# EAGLE design PCB-TLY-BRD-U (EAGLE 6.4)
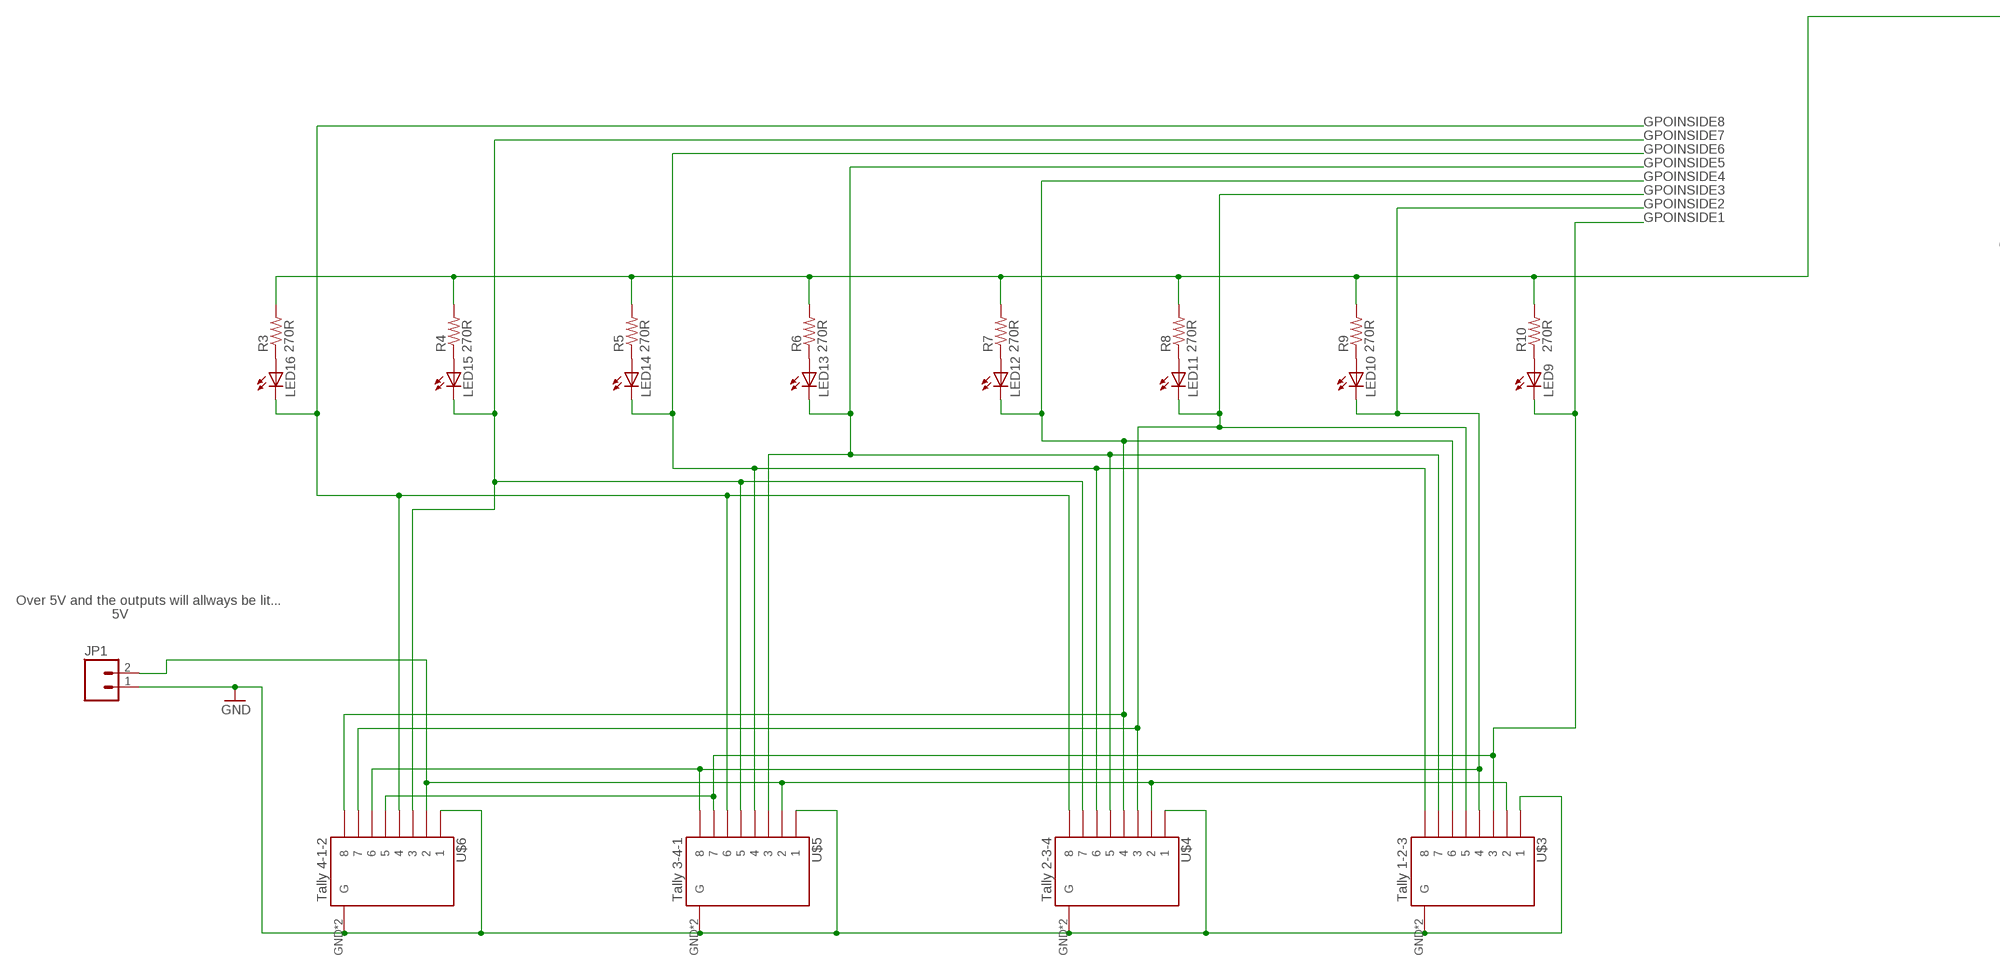
[diagram p0: schematic, sheet 1, part 1 of 2]
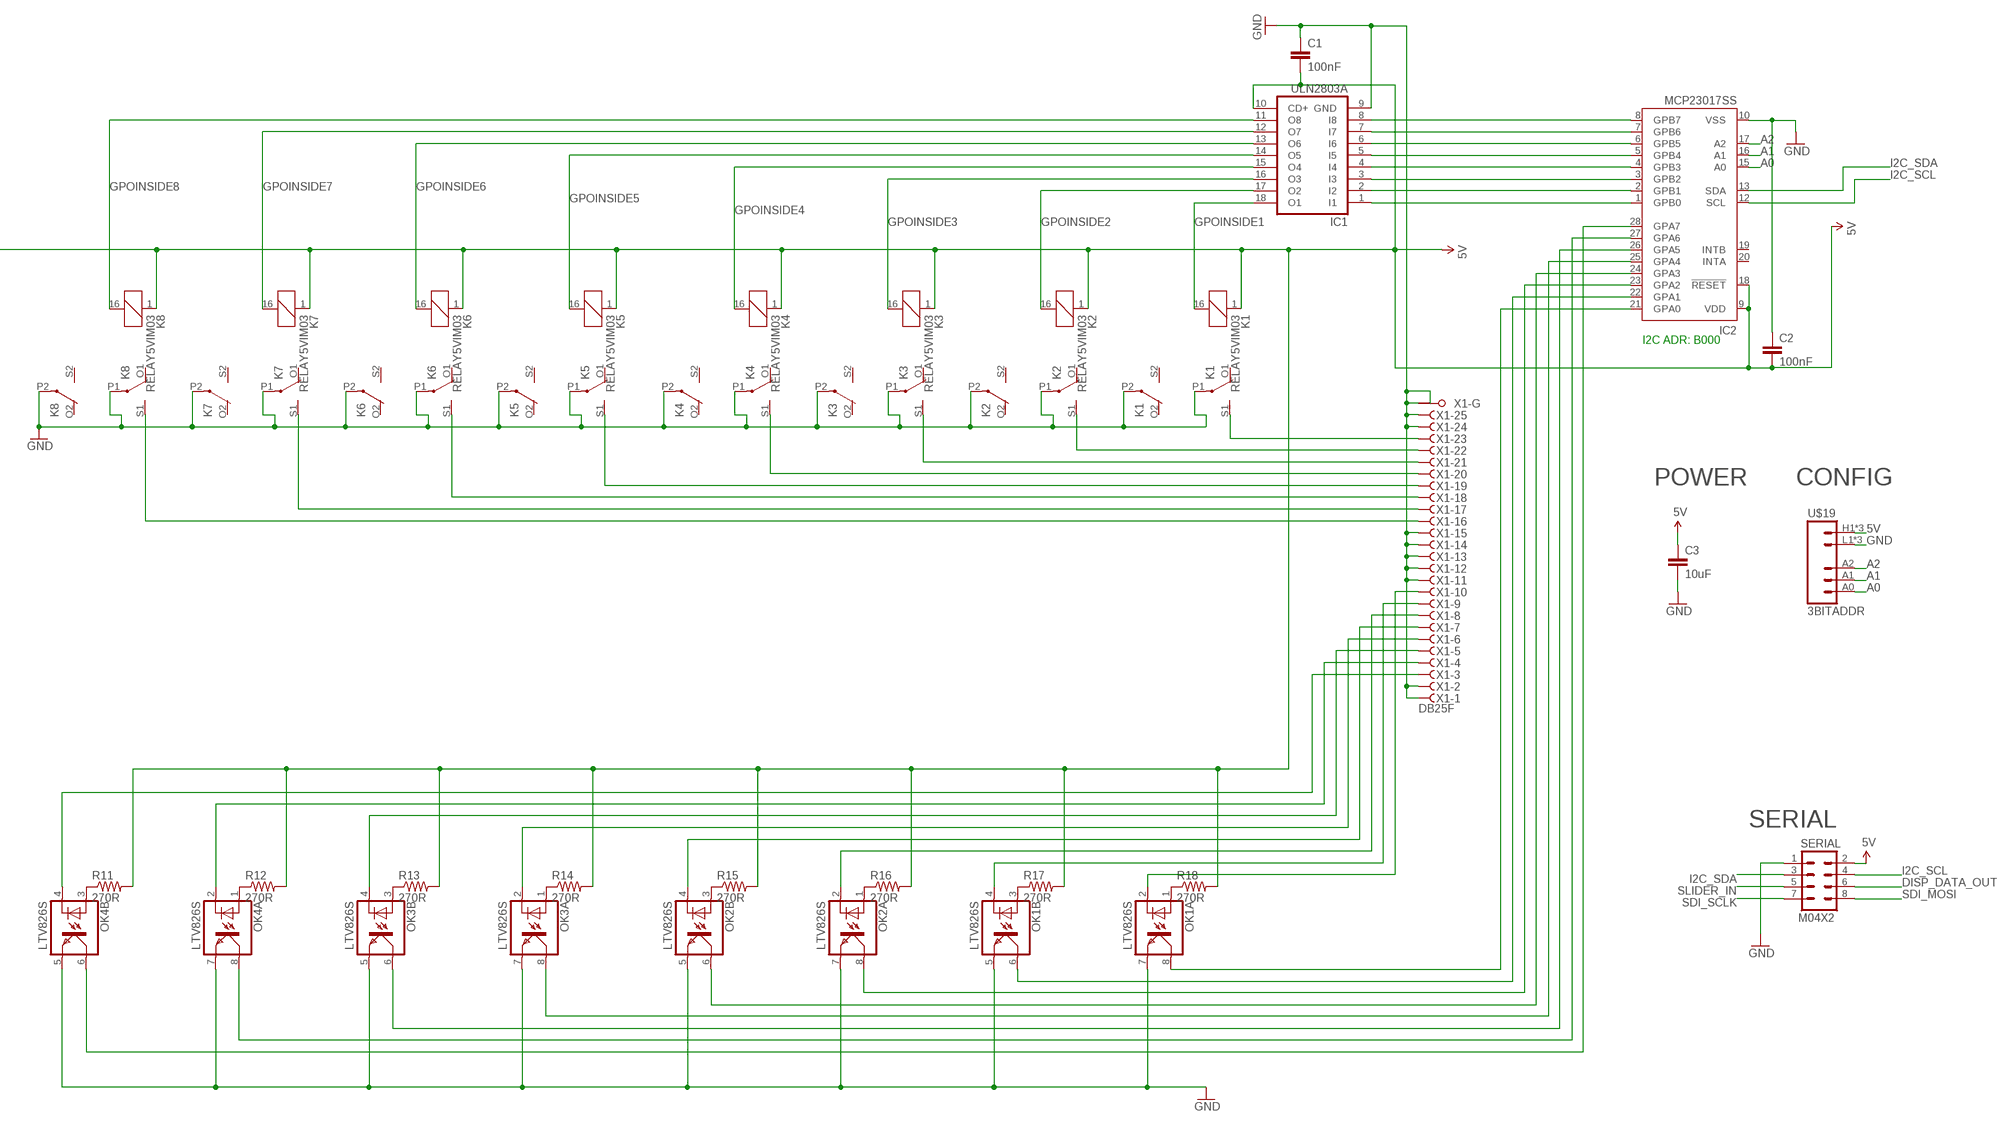
[diagram p1: schematic, sheet 1, part 2 of 2]

## Parts
C1  100nF  CAP0805  [0805]
C2  100nF  CAP0603-CAP  [0603-CAP]
C3  10uF  CAP0805  [0805]
IC1  ULN2803A  ULN2803ASO18W  [SO18W]
IC2  MCP23017SS  [SSOP28]
JP1  M02PTH4  [1X02_XTRA_BIG]
K1  RELAY5VIM03  [DS2Y]
K2  RELAY5VIM03  [DS2Y]
K3  RELAY5VIM03  [DS2Y]
K4  RELAY5VIM03  [DS2Y]
K5  RELAY5VIM03  [DS2Y]
K6  RELAY5VIM03  [DS2Y]
K7  RELAY5VIM03  [DS2Y]
K8  RELAY5VIM03  [DS2Y]
LED9  LED3MM  [LED3MM]
LED10  LED3MM  [LED3MM]
LED11  LED3MM  [LED3MM]
LED12  LED3MM  [LED3MM]
LED13  LED3MM  [LED3MM]
LED14  LED3MM  [LED3MM]
LED15  LED3MM  [LED3MM]
LED16  LED3MM  [LED3MM]
OK1  LTV826S  [DIL8-SMD]
OK2  LTV826S  [DIL8-SMD]
OK3  LTV826S  [DIL8-SMD]
OK4  LTV826S  [DIL8-SMD]
R3  270R  RESISTOR0603-RES  [0603-RES]
R4  270R  RESISTOR0603-RES  [0603-RES]
R5  270R  RESISTOR0603-RES  [0603-RES]
R6  270R  RESISTOR0603-RES  [0603-RES]
R7  270R  RESISTOR0603-RES  [0603-RES]
R8  270R  RESISTOR0603-RES  [0603-RES]
R9  270R  RESISTOR0603-RES  [0603-RES]
R10  270R  RESISTOR0603-RES  [0603-RES]
R11  270R  RESISTOR0603-RES  [0603-RES]
R12  270R  RESISTOR0603-RES  [0603-RES]
R13  270R  RESISTOR0603-RES  [0603-RES]
R14  270R  RESISTOR0603-RES  [0603-RES]
R15  270R  RESISTOR0603-RES  [0603-RES]
R16  270R  RESISTOR0603-RES  [0603-RES]
R17  270R  RESISTOR0603-RES  [0603-RES]
R18  270R  RESISTOR0603-RES  [0603-RES]
SERIAL  M04X2  [2X4]
U$3  Tally 1-2-3  RJ45-8_GND  [RJ45-8_GND]
U$4  Tally 2-3-4  RJ45-8_GND  [RJ45-8_GND]
U$5  Tally 3-4-1  RJ45-8_GND  [RJ45-8_GND]
U$6  Tally 4-1-2  RJ45-8_GND  [RJ45-8_GND]
U$19  3BITADDR  [3BITADDR]
X1  DB25F  F25HPS  [F25HP]

## Nets
5V [Power]: C1.2 C2.2 C3.1 IC1.10(CD+) IC2.9(VDD) IC2.18(!RESET) K1.1 K2.1 K3.1 K4.1 K5.1 K6.1 K7.1 K8.1 R3.2 R4.2 R5.2 R6.2 R7.2 R8.2 R9.2 R10.2 R11.2 R12.2 R13.2 R14.2 R15.2 R16.2 R17.2 R18.2 SERIAL.2 U$19.H1(VCC) U$19.H2(VCC) U$19.H3(VCC)
A0: IC2.15(A0) U$19.A0
A1: IC2.16(A1) U$19.A1
A2: IC2.17(A2) U$19.A2
DISP_DATA_OUT: SERIAL.6
GND [Power]: C1.1 C2.1 C3.2 IC1.9(GND) IC2.10(VSS) JP1.1 K1.P1(2:P) K1.P2(3:P) K2.P1(2:P) K2.P2(3:P) K3.P1(2:P) K3.P2(3:P) K4.P1(2:P) K4.P2(3:P) K5.P1(2:P) K5.P2(3:P) K6.P1(2:P) K6.P2(3:P) K7.P1(2:P) K7.P2(3:P) K8.P1(2:P) K8.P2(3:P) OK1.5(B:EMIT) OK1.7(A:EMIT) OK2.5(B:EMIT) OK2.7(A:EMIT) OK3.5(B:EMIT) OK3.7(A:EMIT) OK4.5(B:EMIT) OK4.7(A:EMIT) SERIAL.1 U$3.1 U$3.GND1(G) U$3.GND(G) U$4.1 U$4.GND1(G) U$4.GND(G) U$5.1 U$5.GND1(G) U$5.GND(G) U$6.1 U$6.GND1(G) U$6.GND(G) U$19.L1(GND) U$19.L2(GND) U$19.L3(GND) X1.1(-1:F) X1.2(-2:F) X1.11(-11:F) X1.12(-12:F) X1.13(-13:F) X1.14(-14:F) X1.15(-15:F) X1.24(-24:F) X1.25(-25:F) X1.G1(-G:G1) X1.G2(-G:G2)
GPOINSIDE1: IC1.18(O1) K1.16 LED9.K(C) U$3.3 U$5.7 U$6.5
GPOINSIDE2: IC1.17(O2) K2.16 LED10.K(C) U$3.4 U$5.8 U$6.6
GPOINSIDE3: IC1.16(O3) K3.16 LED11.K(C) U$3.5 U$4.3 U$6.7
GPOINSIDE4: IC1.15(O4) K4.16 LED12.K(C) U$3.6 U$4.4 U$6.8
GPOINSIDE5: IC1.14(O5) K5.16 LED13.K(C) U$3.7 U$4.5 U$5.3
GPOINSIDE6: IC1.13(O6) K6.16 LED14.K(C) U$3.8 U$4.6 U$5.4
GPOINSIDE7: IC1.12(O7) K7.16 LED15.K(C) U$4.7 U$5.5 U$6.3
GPOINSIDE8: IC1.11(O8) K8.16 LED16.K(C) U$4.8 U$5.6 U$6.4
I2C_SCL: IC2.12(SCL) SERIAL.4
I2C_SDA: IC2.13(SDA) SERIAL.3
N$1 [RELAY LINES]: K1.S1(2:S) X1.23(-23:F)
N$2: LED16.A R3.1
N$3: LED15.A R4.1
N$4: LED14.A R5.1
N$5: IC1.1(I1) IC2.1(GPB0)
N$6 [RELAY LINES]: K2.S1(2:S) X1.22(-22:F)
N$7: LED13.A R6.1
N$8: LED12.A R7.1
N$9: LED11.A R8.1
N$10 [RELAY LINES]: K3.S1(2:S) X1.21(-21:F)
N$11: LED10.A R9.1
N$12: LED9.A R10.1
N$13: OK4.3(B:A) R11.1
N$14 [RELAY LINES]: K4.S1(2:S) X1.20(-20:F)
N$15: OK4.1(A:A) R12.1
N$16: OK3.3(B:A) R13.1
N$17: OK3.1(A:A) R14.1
N$18 [RELAY LINES]: K5.S1(2:S) X1.19(-19:F)
N$19: OK2.3(B:A) R15.1
N$20: OK2.1(A:A) R16.1
N$21: OK1.3(B:A) R17.1
N$22 [RELAY LINES]: K6.S1(2:S) X1.18(-18:F)
N$23: OK1.1(A:A) R18.1
N$26 [RELAY LINES]: K7.S1(2:S) X1.17(-17:F)
N$30 [RELAY LINES]: K8.S1(2:S) X1.16(-16:F)
N$34: IC1.2(I2) IC2.2(GPB1)
N$35: IC1.3(I3) IC2.3(GPB2)
N$36: IC1.4(I4) IC2.4(GPB3)
N$37: IC1.5(I5) IC2.5(GPB4)
N$38: IC1.6(I6) IC2.6(GPB5)
N$39: IC1.7(I7) IC2.7(GPB6)
N$40: IC1.8(I8) IC2.8(GPB7)
N$49 [INput lines]: OK1.2(A:C) X1.10(-10:F)
N$51: IC2.21(GPA0) OK1.8(A:COL)
N$55 [INput lines]: OK3.2(A:C) X1.6(-6:F)
N$60 [INput lines]: OK1.4(B:C) X1.9(-9:F)
N$61 [INput lines]: OK2.2(A:C) X1.8(-8:F)
N$62 [INput lines]: OK2.4(B:C) X1.7(-7:F)
N$63: IC2.28(GPA7) OK4.6(B:COL)
N$64 [INput lines]: OK3.4(B:C) X1.5(-5:F)
N$65 [INput lines]: OK4.2(A:C) X1.4(-4:F)
N$66 [INput lines]: OK4.4(B:C) X1.3(-3:F)
N$68: IC2.22(GPA1) OK1.6(B:COL)
N$69: IC2.23(GPA2) OK2.8(A:COL)
N$70: IC2.24(GPA3) OK2.6(B:COL)
N$71: IC2.25(GPA4) OK3.8(A:COL)
N$72: IC2.26(GPA5) OK3.6(B:COL)
N$73: IC2.27(GPA6) OK4.8(A:COL)
N$82: JP1.2 U$3.2 U$4.2 U$5.2 U$6.2
SDI_MOSI: SERIAL.8
SDI_SCLK: SERIAL.7
SLIDER_IN: SERIAL.5
Unconnected: IC2.19(INTB) IC2.20(INTA) K1.O1(2:O) K1.O2(3:O) K1.S2(3:S) K2.O1(2:O) K2.O2(3:O) K2.S2(3:S) K3.O1(2:O) K3.O2(3:O) K3.S2(3:S) K4.O1(2:O) K4.O2(3:O) K4.S2(3:S) K5.O1(2:O) K5.O2(3:O) K5.S2(3:S) K6.O1(2:O) K6.O2(3:O) K6.S2(3:S) K7.O1(2:O) K7.O2(3:O) K7.S2(3:S) K8.O1(2:O) K8.O2(3:O) K8.S2(3:S)

## Notes on the sheet
- I2C ADR: B000
- POWER | CONFIG
- Over 5V and the outputs will allways be lit...
- 5V
- SERIAL

## Library data of the parts
C1-C3 = SparkFun:CAP: Capacitor Standard 0603 ceramic capacitor, and 0.1" leaded capacitor.
IC1 = uln-udn:ULN2803A: DRIVER ARRAY
IC2 = microchip:MCP23017: http://ww1.microchip.com/downloads/en/DeviceDoc/21952a.pdf Source: http://ww1.microchip.com/downloads/en/DeviceDoc/21952a.pdf; MF: MICROCHIP; MPN: MCP23017-E/SS; OC_FARNELL: 1467674; OC_NEWARK: 31K2960
JP1 = SparkFun:M02: Header 2 Standard 2-pin 0.1" header. Use with straight break away headers (SKU : PRT-00116), right angle break away headers (PRT-00553), swiss pins (PRT-00743), machine pins (PRT-00117), and female headers (PRT-00115). Molex polarized connector foot print use with SKU : PRT-08233 with associated crimp pins and housings.
K1-K8 = SKAARHOJ:RELAY5V: RELAY 2 x switch, AxiCom 150 mW 5V
LED9-LED16 = led:LED: LED OSRAM: - CHIPLED LG R971, LG N971, LY N971, LG Q971, LY Q971, LO R971, LY R971 LH N974, LH R974 LS Q976, LO Q976, LY Q976 LO Q996 - Hyper CHIPLED LW Q18S LB Q993, LB Q99A, LB R99A - SideLED LS A670, LO A670, LY A670, LG A670, LP A670 LB A673, LV A673, LT A673, LW A673 LH A674 LY A675 LS A676, LA A676, LO A676, LY A676, LW A676 LS A679, LY A679, LG A679 - Hyper Micro SIDELED® LS Y876, LA Y876, LO Y876, LY Y876 LT Y87S - SmartLED LW L88C, LW L88S LB L89C, LB L89S, LG L890 LS L89K, LO L89K, LY L89K LS L896, LA L896, LO L896, LY L896 - TOPLED LS T670, LO T670, LY T670, LG T670, LP T670 LSG T670, LSP T670, LSY T670, LOP T670, LYG T670 LG T671, LOG T671, LSG T671 LB T673, LV T673, LT T673, LW T673 LH T674 LS T676, LA T676, LO T676, LY T676, LB T676, LH T676, LSB T676, LW T676 LB T67C, LV T67C, LT T67C, LS T67K, LO T67K, LY T67K, LW E67C LS E67B, LA E67B, LO E67B, LY E67B, LB E67C, LV E67C, LT E67C LW T67C LS T679, LY T679, LG T679 LS T770, LO T770, LY T770, LG T770, LP T770 LB T773, LV T773, LT T773, LW T773 LH T774 LS E675, LA E675, LY E675, LS T675 LS T776, LA T776, LO T776, LY T776, LB T776 LHGB T686 LT T68C, LB T68C - Hyper Mini TOPLED® LB M676 - Mini TOPLED Santana® LG M470 LS M47K, LO M47K, LY M47K Source: http://www.osram.convergy.de LUXEON: - LUMILED® LXK2-PW12-R00, LXK2-PW12-S00, LXK2-PW14-U00, LXK2-PW14-V00 LXK2-PM12-R00, LXK2-PM12-S00, LXK2-PM14-U00 LXK2-PE12-Q00, LXK2-PE12-R00, LXK2-PE12-S00, LXK2-PE14-T00, LXK2-PE14-U00 LXK2-PB12-K00, LXK2-PB12-L00, LXK2-PB12-M00, LXK2-PB14-N00, LXK2-PB14-P00, LXK2-PB14-Q00 LXK2-PR12-L00, LXK2-PR12-M00, LXK2-PR14-Q00, LXK2-PR14-R00 LXK2-PD12-Q00, LXK2-PD12-R00, LXK2-PD12-S00 LXK2-PH12-R00, LXK2-PH12-S00 LXK2-PL12-P00, LXK2-PL12-Q00, LXK2-PL12-R00 Source: www.luxeon.com KINGBRIGHT: KA-3528ASYC Source: www.kingbright.com
OK1-OK4 = optocoupler:LTV826: OPTO COUPLER Source: LITEON, LTV816.pdf; OC_FARNELL: unknown; OC_NEWARK: unknown
R3-R18 = SparkFun:RESISTOR: Resistor Basic schematic elements and footprints for 0603, 1206, and PTH resistors.
SERIAL = SparkFun:M04X2
U$3-U$6 = SKAARHOJ:RJ45-8_GND
U$19 = SKAARHOJ:3BITADDR
X1 = con-subd:F25HPS: SUB-D; OC_FARNELL: unknown; OC_NEWARK: unknown

## Net classes
0 default: width 0.203 mm, drill 0.406 mm, clearance 0.203 mm
1 Power: width 0.406 mm, drill 0.61 mm, clearance 0.203 mm
2 RELAY LINES: width 0.305 mm, clearance 0.254 mm
3 INput lines: clearance 0.254 mm

## Board
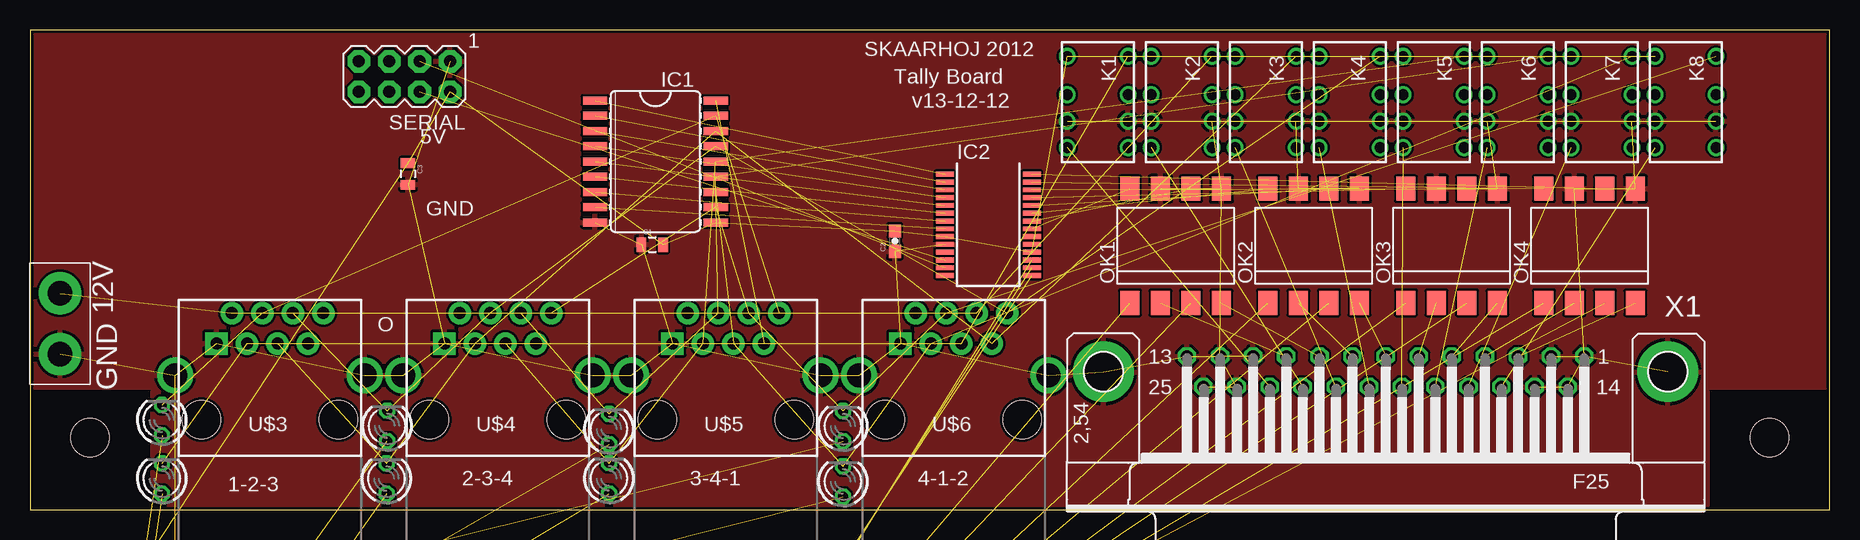
[diagram p2: board, top side]
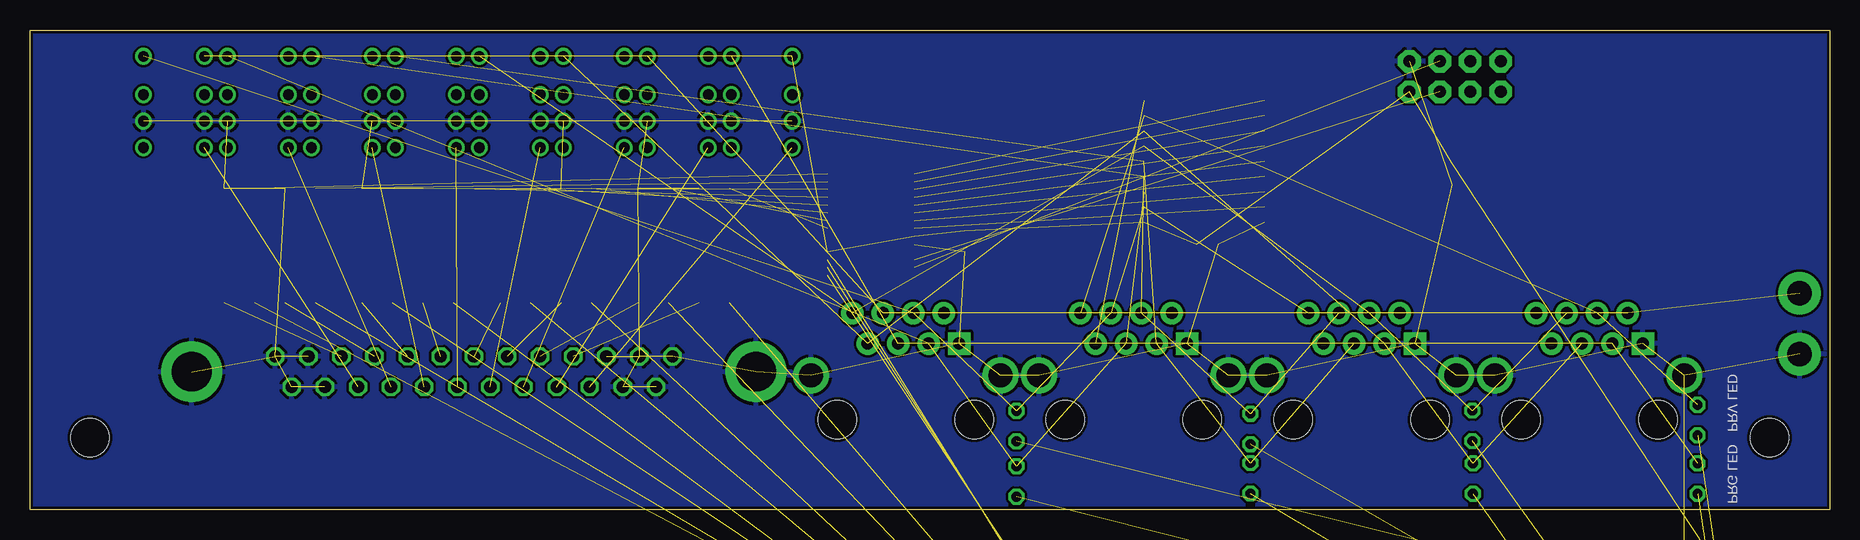
[diagram p3: board, bottom side, seen from below]

Size 150 x 40 mm. Coordinates in mm from the lower left corner, seen from the top.
Outline: 150,0 150,40 0,40 0,0 150,0
Copper layers (1*16): Top 0.035mm / dielectric 1.5mm / Bottom 0.035mm
Design rules "default": minimum track width 6mil, minimum drill 12mil, track to track 6mil, track to pad 6mil, pad to pad 6mil, via to via 6mil, smd to smd 0mil, copper to edge 10mil, drill to drill 10mil, minimum pad ring 10mil, minimum via ring 6mil, stop-mask expansion 2mil, vias tented up to drill 100mil, thermal gap 10mil
Holes 3.2 mm at 5,6 145,6
bKeepout: area 0,0 to 10,10; area 140,0 to 150,10
tRestrict: area 0,0 to 10,10; area 140,0 to 150,10

### Footprints (pad centres in the part's own frame; a part is rotated, then mirrored left to right if it is on the bottom)
0805 = smd 0.8 x 1.2: 1 -0.9,0; 2 0.9,0
0603-CAP = smd 1.1 x 1: 1 -0.85,0; 2 0.85,0
SO18W = smd 0.66 x 2.032: 1 -5.08,-5.029; 2 -3.81,-5.029; 3 -2.54,-5.029; 4 -1.27,-5.029; 5 0,-5.029; 6 1.27,-5.029; 7 2.54,-5.029; 8 3.81,-5.029; 9 5.08,-5.029; 10 5.08,5.029; 11 3.81,5.029; 12 2.54,5.029; 13 1.27,5.029; 14 0,5.029; 15 -1.27,5.029; 16 -2.54,5.029; 17 -3.81,5.029; 18 -5.08,5.029
SSOP28 = smd 0.4 x 1.5: 1 -4.225,-3.625; 2 -3.575,-3.625; 3 -2.925,-3.625; 4 -2.275,-3.625; 5 -1.625,-3.625; 6 -0.975,-3.625; 7 -0.325,-3.625; 8 0.325,-3.625; 9 0.975,-3.625; 10 1.625,-3.625; 11 2.275,-3.625; 12 2.925,-3.625; 13 3.575,-3.625; 14 4.225,-3.625; 15 4.225,3.625; 16 3.575,3.625; 17 2.925,3.625; 18 2.275,3.625; 19 1.625,3.625; 20 0.975,3.625; 21 0.325,3.625; 22 -0.325,3.625; 23 -0.975,3.625; 24 -1.625,3.625; 25 -2.275,3.625; 26 -2.925,3.625; 27 -3.575,3.625; 28 -4.225,3.625
1X02_XTRA_BIG = drill 2.057 pad 3.556: 1 -2.54,0; 2 2.54,0
DS2Y = drill 0.9: 1 1.2,0.46; 16 1.2,5.54; O1 4.4,0.46; O2 4.4,5.54; P1 6.6,0.46; P2 6.6,5.54; S1 8.8,0.46; S2 8.8,5.54
LED3MM = drill 0.813 octagon: A -1.27,0; K 1.27,0
DIL8-SMD = smd 1.6 x 2: 1 -3.81,-4.77; 2 -1.27,-4.77; 3 1.27,-4.77; 4 3.81,-4.77; 5 3.81,4.77; 6 1.27,4.77; 7 -1.27,4.77; 8 -3.81,4.77
0603-RES = smd 1.1 x 1: 1 -0.85,0; 2 0.85,0
2X4 = drill 1.016 pad 1.88 octagon: 1 -3.81,-1.27; 2 -3.81,1.27; 3 -1.27,-1.27; 4 -1.27,1.27; 5 1.27,-1.27; 6 1.27,1.27; 7 3.81,-1.27; 8 3.81,1.27
RJ45-8_GND = drill 1 pad 1.88 square: 1 -4.445,6.35 | drill 1 pad 1.88: 2 -3.175,8.89; 3 -1.905,6.35; 4 -0.635,8.89; 5 0.635,6.35; 6 1.905,8.89; 7 3.175,6.35; 8 4.445,8.89 | drill 2: GND -7.9,3.7; GND1 7.9,3.7 | hole 3.2: -5.715,0; 5.715,0
3BITADDR = drill 0.8: A0 -2,0; A1 0,0; A2 2,0; H1 -2,2; H2 0,2; H3 2,2; L1 -2,-2; L2 0,-2; L3 2,-2
F25HP = drill 1.016 octagon: 1 -16.561,-1.27; 2 -13.792,-1.27; 3 -11.049,-1.27; 4 -8.28,-1.27; 5 -5.512,-1.27; 6 -2.769,-1.27; 7 0,-1.27; 8 2.769,-1.27; 9 5.512,-1.27; 10 8.28,-1.27; 11 11.049,-1.27; 12 13.792,-1.27; 13 16.561,-1.27; 14 -15.189,1.27; 15 -12.421,1.27; 16 -9.652,1.27; 17 -6.909,1.27; 18 -4.14,1.27; 19 -1.372,1.27; 20 1.372,1.27; 21 4.14,1.27; 22 6.909,1.27; 23 9.652,1.27; 24 12.421,1.27; 25 15.189,1.27 | drill 3.302 pad 5.08: G1 -23.52,0; G2 23.52,0

### Placement (x,y rotation side)
C1  51.87,22.09 0 top
C2  72.1,22.39 90 top
C3  31.5,28 270 top
IC1  52.13,29.03 270 top
IC2  79.89,23.75 270 top
JP1  2.5,15.5 90 top
K1  86,39 270 top
K2  93,39 270 top
K3  100,39 270 top
K4  107,39 270 top
K5  114,39 270 top
K6  121,39 270 top
K7  128,39 270 top
K8  135,39 270 top
LED9  11,2.58 90 top
LED10  11,7.46 90 top
LED11  29.72,2.58 90 top
LED12  29.77,6.98 90 top
LED13  48.27,2.6 90 top
LED14  48.27,6.72 90 top
LED15  67.77,2.34 90 top
LED16  67.77,6.96 90 top
OK1  95.5,22 0 top
OK2  107,22 0 top
OK3  118.5,22 0 top
OK4  130,22 0 top
R3  5,-10 0 top  (outside the outline)
R4  5,-15 0 top  (outside the outline)
R5  5,-20 0 top  (outside the outline)
R6  5,-25 0 top  (outside the outline)
R7  5,-30 0 top  (outside the outline)
R8  5,-35 0 top  (outside the outline)
R9  5,-40 0 top  (outside the outline)
R10  5,-45 0 top  (outside the outline)
R11  5,-50 0 top  (outside the outline)
R12  5,-55 0 top  (outside the outline)
R13  5,-60 0 top  (outside the outline)
R14  5,-65 0 top  (outside the outline)
R15  5,-70 0 top  (outside the outline)
R16  5,-75 0 top  (outside the outline)
R17  5,-80 0 top  (outside the outline)
R18  5,-85 0 top  (outside the outline)
SERIAL  31.21,36.12 180 top
U$3  20,7.5 0 top
U$4  39,7.5 0 top
U$5  58,7.5 0 top
U$6  77,7.5 0 top
U$19  10,-95 0 top  (outside the outline)
X1  113,11.5 180 top

### Tracks (layer width: path | path; a pad name or v marks a point on that pad's centre or on a via)
5V  (33 unrouted)
A0  (1 unrouted)
A1  (1 unrouted)
A2  (1 unrouted)
GND  (56 unrouted)
  pour Bottom: 0,0 0,40 150,40 150,0
  pour Top: 0,0 0,40 150,40 150,0
GPOINSIDE1  (5 unrouted)
GPOINSIDE2  (5 unrouted)
GPOINSIDE3  (5 unrouted)
GPOINSIDE4  (5 unrouted)
GPOINSIDE5  (5 unrouted)
GPOINSIDE6  (5 unrouted)
GPOINSIDE7  (5 unrouted)
GPOINSIDE8  (5 unrouted)
I2C_SCL  (1 unrouted)
I2C_SDA  (1 unrouted)
N$1  (1 unrouted)
N$2  (1 unrouted)
N$3  (1 unrouted)
N$4  (1 unrouted)
N$5  (1 unrouted)
N$6  (1 unrouted)
N$7  (1 unrouted)
N$8  (1 unrouted)
N$9  (1 unrouted)
N$10  (1 unrouted)
N$11  (1 unrouted)
N$12  (1 unrouted)
N$13  (1 unrouted)
N$14  (1 unrouted)
N$15  (1 unrouted)
N$16  (1 unrouted)
N$17  (1 unrouted)
N$18  (1 unrouted)
N$19  (1 unrouted)
N$20  (1 unrouted)
N$21  (1 unrouted)
N$22  (1 unrouted)
N$23  (1 unrouted)
N$26  (1 unrouted)
N$30  (1 unrouted)
N$34  (1 unrouted)
N$35  (1 unrouted)
N$36  (1 unrouted)
N$37  (1 unrouted)
N$38  (1 unrouted)
N$39  (1 unrouted)
N$40  (1 unrouted)
N$49  (1 unrouted)
N$51  (1 unrouted)
N$55  (1 unrouted)
N$60  (1 unrouted)
N$61  (1 unrouted)
N$62  (1 unrouted)
N$63  (1 unrouted)
N$64  (1 unrouted)
N$65  (1 unrouted)
N$66  (1 unrouted)
N$68  (1 unrouted)
N$69  (1 unrouted)
N$70  (1 unrouted)
N$71  (1 unrouted)
N$72  (1 unrouted)
N$73  (1 unrouted)
N$82  (4 unrouted)

### Text on the board
_tsilk: 1 | SKAARHOJ 2012 | Tally Board | v13-12-12 | 5V | GND | GND | 12V | O | 1-2-3 | 2-3-4 | 3-4-1 | 4-1-2
_bsilk: PRV LED | PRG LED